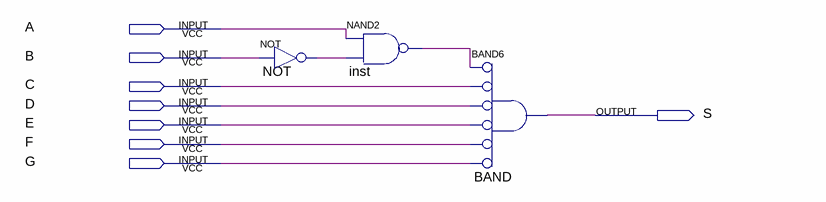
[diagram p0: schematic sheet]
// Quartus schematic Block1.bdf as structural Verilog: 3 symbols, 8 pins
module Block1 (
  input  A,
  input  B,
  input  C,
  input  D,
  input  E,
  input  F,
  input  G,
  output S
);

  wire inst_out, NOT_out;

  not NOT (NOT_out, B);
  nand inst (inst_out, A, NOT_out);
  and BAND (S, ~inst_out, ~C, ~D, ~E, ~F, ~G);  // BAND6
endmodule
